# Altium schematic sheet Display.schdoc
size A4; SheetNumber: 2; SheetTotal: 5
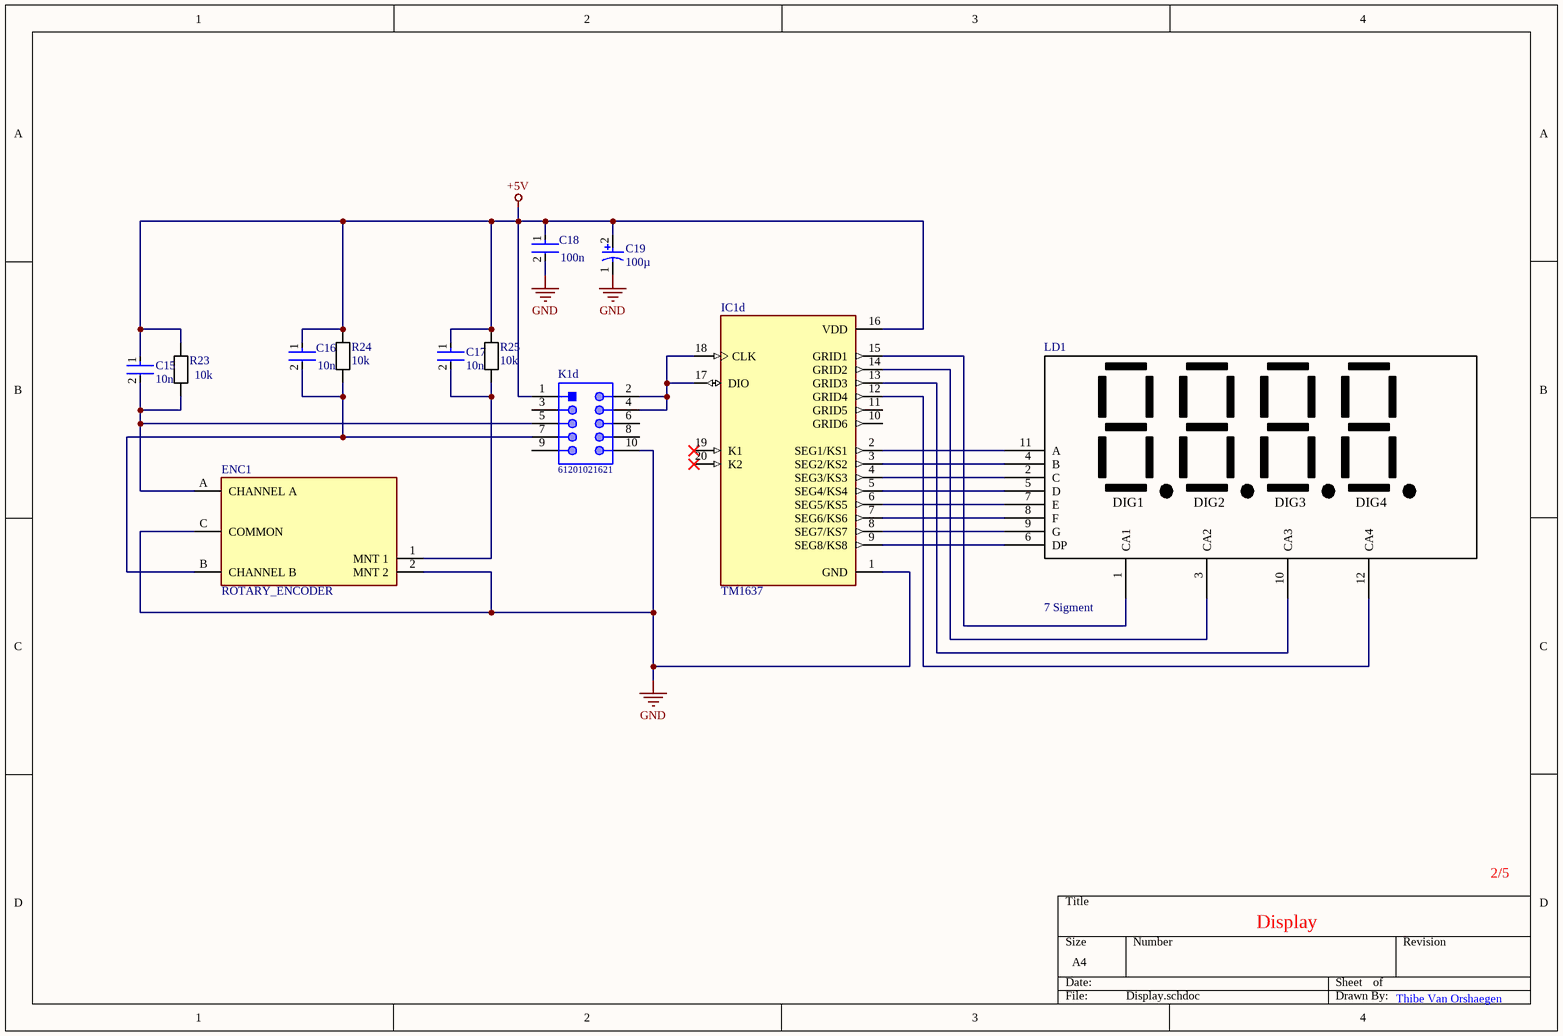
[diagram p0: Display.schdoc]

## Parts
C15  10n  [CC_0805_m]
C16  10n  [CC_0805_m]
C17  10n  [CC_0805_m]
C18  100n  [CC_0805_m]
C19  100µ  [CE_D8_L10]
ENC1  ROTARY_ENCODER  [PEC11R4225FN0024]
IC1d  TM1637  [SOP_20_M]
K1d  61201021621  [box header 10-pin]
LD1  7 Sigment  [DIPS1524W51P254L5040H825Q12N]
R23  10k  [RESC2013X50X30ML20T20]
R24  10k  [RESC2013X50X30ML20T20]
R25  10k  [RESC2013X50X30ML20T20]

## Nets
+5V: C15.1 C16.1 C17.1 C18.1 C19.2 IC1d.16(VDD) K1d.1 R23.2 R24.2 R25.2
GND: C18.2 C19.1 ENC1.2(MNT_2) ENC1.C(COMMON) IC1d.1(GND) K1d.10
NetC15_2: C15.2 ENC1.A(CHANNEL_A) K1d.5 R23.1
NetC16_2: C16.2 ENC1.B(CHANNEL_B) K1d.7 R24.1
NetC17_2: C17.2 ENC1.1(MNT_1) R25.1
NetIC1d_2: IC1d.2(SEG1/KS1) LD1.11(A)
NetIC1d_3: IC1d.3(SEG2/KS2) LD1.4(B)
NetIC1d_4: IC1d.4(SEG3/KS3) LD1.2(C)
NetIC1d_5: IC1d.5(SEG4/KS4) LD1.5(D)
NetIC1d_6: IC1d.6(SEG5/KS5) LD1.7(E)
NetIC1d_7: IC1d.7(SEG6/KS6) LD1.8(F)
NetIC1d_8: IC1d.8(SEG7/KS7) LD1.9(G)
NetIC1d_9: IC1d.9(SEG8/KS8) LD1.6(DP)
NetIC1d_12: IC1d.12(GRID4) LD1.12(CA4)
NetIC1d_13: IC1d.13(GRID3) LD1.10(CA3)
NetIC1d_14: IC1d.14(GRID2) LD1.3(CA2)
NetIC1d_15: IC1d.15(GRID1) LD1.1(CA1)
NetIC1d_17: IC1d.17(DIO) IC1d.18(CLK) K1d.2 K1d.4

Not connected (* = marked no-connect by the designer): IC1d 10(GRID6) 11(GRID5) 19(K1)* 20(K2)*; K1d 3 6 8 9

## Notes on the sheet
- Display
- Thibe Van Orshaegen
- (in symbol 7 Sigment) DIG1; DIG2; DIG3; DIG4

## Library data of the parts
C15-C18 = Capacitor_Ceramic: Manufacturer: KEMET; Manufacturer Part Number: C0805C224K5RACTU; Value: 0.22 μF; Temperature Characteristic: X7R; Temperature Coefficient: 30ppm/°C; Tolerance: 0.1; Voltage Rating: 50 V; ComponentLink2URL: https://content.kemet.com/datasheets/KEM_C1003_C0G_SMD.pdf; Device Class L3: Ceramic Capacitors; Lead Free: Yes; Temperature: -55°C to +125°C; RoHS: TRUE; Capacitance: 0.22 μF; Automotive: No; Material: Ceramic; Octopart: https://octopart.com/c0805c224k5ractu-kemet-144670; Temperature Range Low: -55°C; Height: 0.88mm; Device Class L1: Passive Components; Digikey Description: CAP CER 0.22UF 50V X7R 0805; ComponentLink2Description: Datasheet; Mouser Description: CAP CER 0.22UF 50V X7R 0805; Category: Cap; Ipc Land Pattern Name: CAPC200125X78; Temperature Range High: +125°C; Package: C0805C-DN; Device Class L2: Capacitors
C19 = Capacitor_Electrolytic: Manufacturer: Panasonic; Voltage Rating: 25 V; ComponentLink2URL: http://industrial.panasonic.com/cdbs/www-data/pdf/RDE0000/ABA0000C1181.pdf; Height: 10.2 mm; Max Operating Temperature: 105 degC; PackageReference: EEE-FK1E221P; ComponentLink1Description: Manufacturer URL; ComponentLink1URL: http://www.panasonic.com/; Mount: Surface Mount; REACH SVHC: No SVHC; Min Operating Temperature: -55 degC; ComponentLink2Description: Datasheet; DatasheetVersion: 03/2016; Length: 10.2 mm; RoHSCompliant: true; Packaging: Tape and Reel; Package Quantity: 500; Lead Pitch: 3.1 mm; Pins: 2; PackageDescription: 2-Pin Electrolytic Aluminum Capacitor, Body 8.3 x 8.3 mm; Mounting Technology: Surface Mount
ENC1 = ROTARY_ENCODER: Manufacturer Part Number: PEC11R-4015F-N0024; Manufacturer: Bourns; Current Rating: 10mA; Number Of Circuits: 1; Conn Orientation: Vertical; Encoder Type: Incremental; Detent: No; Pulses Per Rev: 24; Voltage Rating Dc: 5V; Height: 22.3mm; ComponentLink2URL: https://www.bourns.com/docs/product-datasheets/pec11r.pdf?sfvrsn=bb617cbf_7; Mouser Description: Encoders 15mm SHAFT NO SWITCH; Package: 0; RoHS: TRUE; Temperature Range High: +70°C; Device Class L1: Electromechanical; Device Class L3: Encoders; Temperature Range Low: -30°C; Device Class L2: Switches; Temperature: -30°C to +70°C; Category: Enc; ComponentLink2Description: Datasheet; Lead Free: Yes; Automotive: No; Octopart: https://octopart.com/pec11r-4015f-n0024-bourns-26648251; Digikey Description: ROTARY ENCODER MECHANICAL 24PPR
IC1d = TM1637: LED Drive Control Special Circuit; MF: Titan Micro Electronics; Package: Package; Availability: Not in stock; SnapEDA_Link: https://www.snapeda.com/parts/TM1637/Titan+Micro+Electronics/view-part/?ref=snap; MP: TM1637; Check_prices: https://www.snapeda.com/parts/TM1637/Titan+Micro+Electronics/view-part/?ref=eda; Value: *; Price: None
K1d = Box Header: Male Box Header WR-BHD, THT, Vertical, pitch 2.54 mm, 10 pins; Manufacturer: Wurth Elektronik; Contact Resistance: 20mOhm; Withstanding Voltage: 500VAC; Pin Number: 10; Working Voltage: 250VAC; Pitch: 2.54mm; Mounting Technology: THT; Operating Temperature: -40to125degC; Published Date: August2018; Gender: Male; Packaging: Tray; Manufacturer URL: http://www.we-online.de; Datasheet URL: https://katalog.we-online.de/em/datasheet/6120xx21621.pdf; Orientation: Vertical; Package Reference: 61201021621; Part Number: 61201021621; Publisher: WurthElektronik
R23-R25 = Weerstand: Manufacturer: Vishay Dale; Part Number: CRCW08050000Z0EA